# EAGLE design walkgeek (EAGLE 6.4)
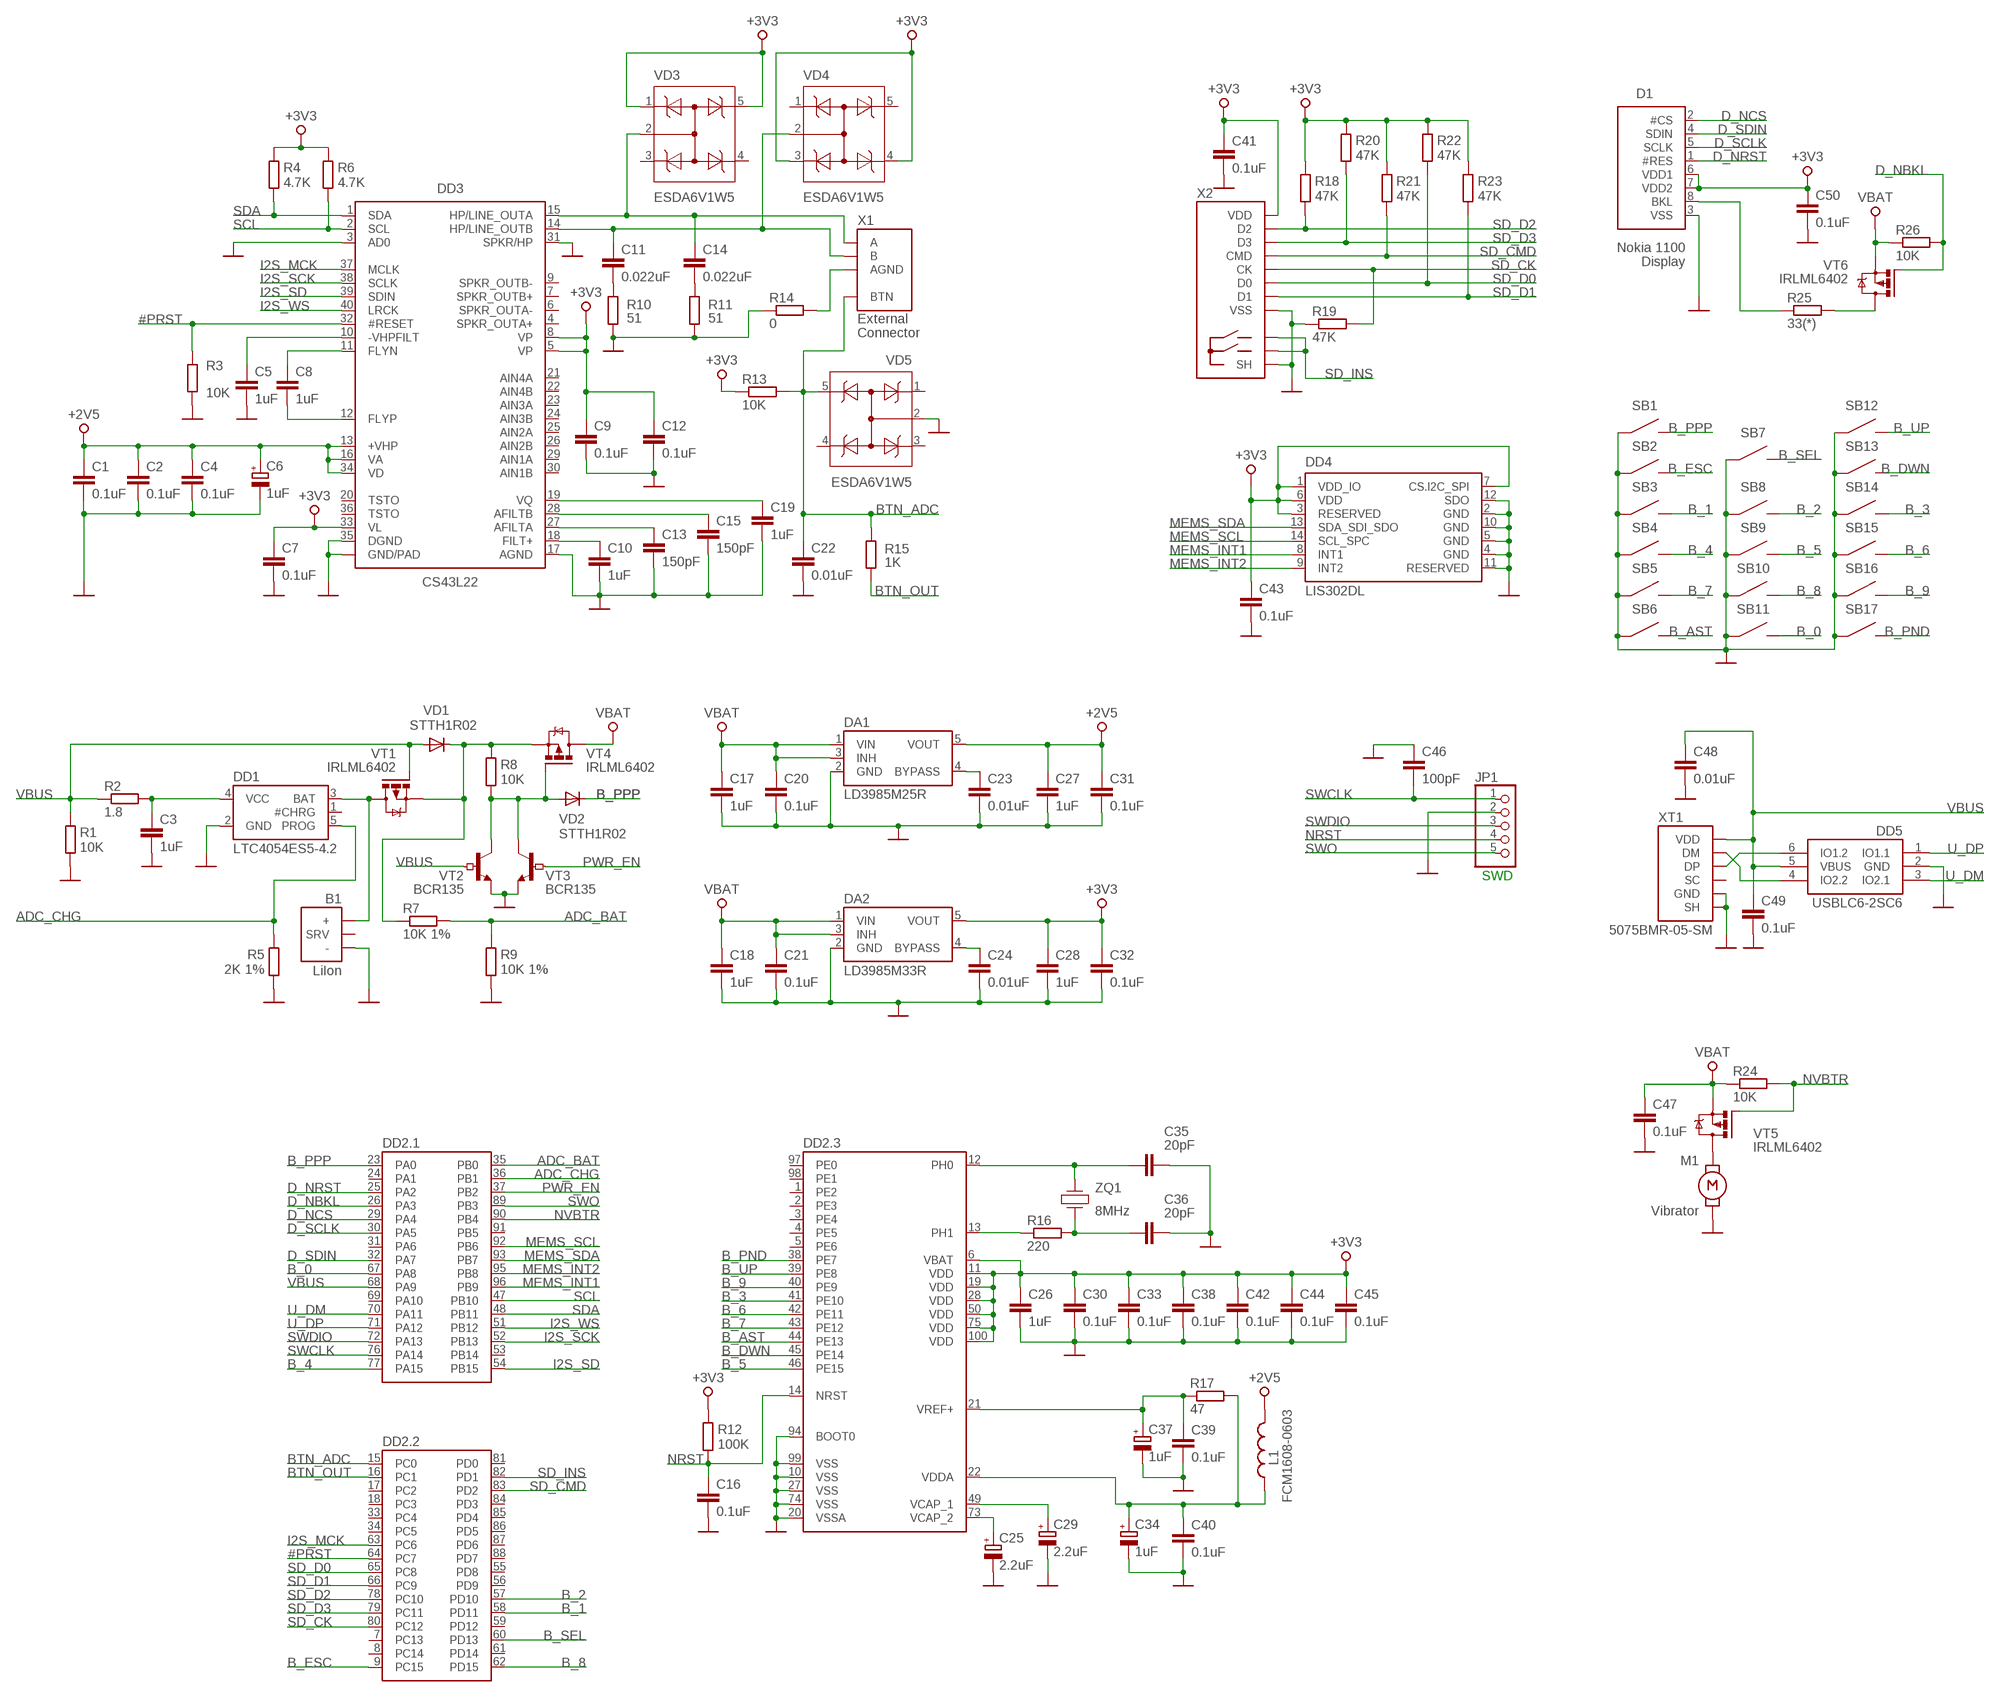
[diagram p0: schematic, sheet 1]

## Parts
B1  NOKIA1100_BATTERY_CONN  [NOKIA1100_BATTERY_CONN]
C1  0.1uF  C-EUC0402  [C0402]
C2  0.1uF  C-EUC0402  [C0402]
C3  1uF  C-EUC0805  [C0805]
C4  0.1uF  C-EUC0402  [C0402]
C5  1uF  C-EUC0603  [C0603]
C6  1uF  CPOL-EUSMCA  [SMC_A]
C7  0.1uF  C-EUC0402  [C0402]
C8  1uF  C-EUC0603  [C0603]
C9  0.1uF  C-EUC0402  [C0402]
C10  1uF  C-EUC0603  [C0603]
C11  0.022uF  C-EUC0603  [C0603]
C12  0.1uF  C-EUC0402  [C0402]
C13  150pF  C-EUC0603  [C0603]
C14  0.022uF  C-EUC0603  [C0603]
C15  150pF  C-EUC0603  [C0603]
C16  0.1uF  C-EUC0402  [C0402]
C17  1uF  C-EUC0603  [C0603]
C18  1uF  C-EUC0603  [C0603]
C19  1uF  C-EUC0603  [C0603]
C20  0.1uF  C-EUC0402  [C0402]
C21  0.1uF  C-EUC0402  [C0402]
C22  0.01uF  C-EUC0805  [C0805]
C23  0.01uF  C-EUC0603  [C0603]
C24  0.01uF  C-EUC0603  [C0603]
C25  2.2uF  CPOL-EUSMCA  [SMC_A]
C26  1uF  C-EUC0603  [C0603]
C27  1uF  C-EUC0603  [C0603]
C28  1uF  C-EUC0603  [C0603]
C29  2.2uF  CPOL-EUSMCA  [SMC_A]
C30  0.1uF  C-EUC0402  [C0402]
C31  0.1uF  C-EUC0402  [C0402]
C32  0.1uF  C-EUC0402  [C0402]
C33  0.1uF  C-EUC0402  [C0402]
C34  1uF  CPOL-EUSMCA  [SMC_A]
C35  20pF  C-EUC0603  [C0603]
C36  20pF  C-EUC0603  [C0603]
C37  1uF  CPOL-EUSMCA  [SMC_A]
C38  0.1uF  C-EUC0402  [C0402]
C39  0.1uF  C-EUC0402  [C0402]
C40  0.1uF  C-EUC0402  [C0402]
C41  0.1uF  C-EUC0402  [C0402]
C42  0.1uF  C-EUC0402  [C0402]
C43  0.1uF  C-EUC0402  [C0402]
C44  0.1uF  C-EUC0402  [C0402]
C45  0.1uF  C-EUC0402  [C0402]
C46  100pF  C-EUC0805  [C0805]
C47  0.1uF  C-EUC0402  [C0402]
C48  0.01uF  C-EUC0603  [C0603]
C49  0.1uF  C-EUC0402  [C0402]
C50  0.1uF  C-EUC0805  [C0805]
D1  NOKIA1100_DISP  [NOKIA1100_DISP]
DA1  LD3985M25R  LD3985MXXR  [TSOT23-5]
DA2  LD3985M33R  LD3985MXXR  [TSOT23-5]
DD1  LTC4054ES5-4.2  [TSOT23-5]
DD2  STM32F4XXVXT  [LQFP100]
DD3  CS43L22  [QFN40-6X6]
DD4  LIS302DL  [LGA14]
DD5  USBLC6-2SC6  [SOT23-6L]
JP1  PINHD-1X5  [1X05/90_FLAT]
L1  FCM1608-0603  FCM1608  [R0603]
M1  NOKIA1100_VIBRATOR  [NOKIA1100_VIBRATOR]
R1  10K  R-EU_R0603  [R0603]
R2  1.8  R-EU_R1206  [R1206]
R3  10K  R-EU_R0402  [R0402]
R4  4.7K  R-EU_R0603  [R0603]
R5  2K 1%  R-EU_R0805  [R0805]
R6  4.7K  R-EU_R0603  [R0603]
R7  10K 1%  R-EU_R0805  [R0805]
R8  10K  R-EU_R0805  [R0805]
R9  10K 1%  R-EU_R0805  [R0805]
R10  51  R-EU_R0603  [R0603]
R11  51  R-EU_R0603  [R0603]
R12  100K  R-EU_R0603  [R0603]
R13  10K  R-EU_R0805  [R0805]
R14  0  R-EU_R0603  [R0603]
R15  1K  R-EU_R0805  [R0805]
R16  220  R-EU_R0603  [R0603]
R17  47  R-EU_R0603  [R0603]
R18  47K  R-EU_R0805  [R0805]
R19  47K  R-EU_R0805  [R0805]
R20  47K  R-EU_R0805  [R0805]
R21  47K  R-EU_R0805  [R0805]
R22  47K  R-EU_R0805  [R0805]
R23  47K  R-EU_R0805  [R0805]
R24  10K  R-EU_R0603  [R0603]
R25  33(*)  R-EU_R1206  [R1206]
R26  10K  R-EU_R0603  [R0603]
SB1  NOKIA1100_KEY_PAD_0  [NOKIA1100_KEY_PAD_0]
SB2  NOKIA1100_KEY_PAD_0  [NOKIA1100_KEY_PAD_0]
SB3  NOKIA1100_KEY_PAD_0  [NOKIA1100_KEY_PAD_0]
SB4  NOKIA1100_KEY_PAD_0  [NOKIA1100_KEY_PAD_0]
SB5  NOKIA1100_KEY_PAD_0  [NOKIA1100_KEY_PAD_0]
SB6  NOKIA1100_KEY_PAD_0  [NOKIA1100_KEY_PAD_0]
SB7  NOKIA1100_KEY_PAD_0  [NOKIA1100_KEY_PAD_0]
SB8  NOKIA1100_KEY_PAD_0  [NOKIA1100_KEY_PAD_0]
SB9  NOKIA1100_KEY_PAD_0  [NOKIA1100_KEY_PAD_0]
SB10  NOKIA1100_KEY_PAD_0  [NOKIA1100_KEY_PAD_0]
SB11  NOKIA1100_KEY_PAD_0  [NOKIA1100_KEY_PAD_0]
SB12  NOKIA1100_KEY_PAD_0  [NOKIA1100_KEY_PAD_0]
SB13  NOKIA1100_KEY_PAD_0  [NOKIA1100_KEY_PAD_0]
SB14  NOKIA1100_KEY_PAD_0  [NOKIA1100_KEY_PAD_0]
SB15  NOKIA1100_KEY_PAD_0  [NOKIA1100_KEY_PAD_0]
SB16  NOKIA1100_KEY_PAD_0  [NOKIA1100_KEY_PAD_0]
SB17  NOKIA1100_KEY_PAD_0  [NOKIA1100_KEY_PAD_0]
VD1  STTH1R02  VD-SMA  [SMA]
VD2  STTH1R02  VD-SMA  [SMA]
VD3  ESDA6V1W5  [SOT323-5L]
VD4  ESDA6V1W5  [SOT323-5L]
VD5  ESDA6V1W5  [SOT323-5L]
VT1  IRLML6402  [MICRO3]
VT2  BCR135  VT_NPN_DIGITAL  [SOT23-BEC]
VT3  BCR135  VT_NPN_DIGITAL  [SOT23-BEC]
VT4  IRLML6402  [MICRO3]
VT5  IRLML6402  [MICRO3]
VT6  IRLML6402  [MICRO3]
X1  NOKIA1100_EXT_CONN  [NOKIA1100_EXT_CONN]
X2  MICROSD_CONN  [TFC-WPCE-08]
XT1  5075BMR-05-SM  USB_MINI_CONN  [32005-201]
ZQ1  8MHz  QUARTZ_5MM  [QUARTZ_5MM]

## Nets
#PRST: DD2.64(.2:PC7) DD3.32(#RESET) R3.2
+2V5: C1.1 C2.1 C4.1 C6.+ C27.1 C31.1 DA1.5(VOUT) DD3.13(+VHP) DD3.16(VA) DD3.34(VD) L1.1
+3V3: C7.1 C9.1 C12.1 C26.1 C28.1 C30.1 C32.1 C33.1 C38.1 C41.1 C42.1 C43.1 C44.1 C45.1 C50.1 D1.6(VDD1) D1.7(VDD2) DA2.5(VOUT) DD2.6(.3:VBAT) DD2.11(.3:VDD) DD2.19(.3:VDD) DD2.28(.3:VDD) DD2.50(.3:VDD) DD2.75(.3:VDD) DD2.100(.3:VDD) DD3.5(VP) DD3.8(VP) DD3.33(VL) DD4.1(VDD_IO) DD4.3(RESERVED) DD4.6(VDD) DD4.7(CS.I2C_SPI) R4.2 R6.2 R12.2 R13.1 R18.2 R20.2 R21.2 R22.2 R23.2 VD3.1 VD3.5 VD4.3 VD4.4 X2.VDD
ADC_BAT: DD2.35(.1:PB0) R7.2 R9.2
ADC_CHG: DD1.5(PROG) DD2.36(.1:PB1) R5.2
B_0: DD2.67(.1:PA8) SB11.INNER
B_1: DD2.58(.2:PD11) SB3.INNER
B_2: DD2.57(.2:PD10) SB8.INNER
B_3: DD2.41(.3:PE10) SB14.INNER
B_4: DD2.77(.1:PA15) SB4.INNER
B_5: DD2.46(.3:PE15) SB9.INNER
B_6: DD2.42(.3:PE11) SB15.INNER
B_7: DD2.43(.3:PE12) SB5.INNER
B_8: DD2.62(.2:PD15) SB10.INNER
B_9: DD2.40(.3:PE9) SB16.INNER
B_AST: DD2.44(.3:PE13) SB6.INNER
B_DWN: DD2.45(.3:PE14) SB13.INNER
B_ESC: DD2.9(.2:PC15) SB2.INNER
B_PND: DD2.38(.3:PE7) SB17.INNER
B_PPP: DD2.23(.1:PA0) SB1.INNER VD2.C
B_SEL: DD2.60(.2:PD13) SB7.INNER
B_UP: DD2.39(.3:PE8) SB12.INNER
BTN_ADC: C22.1 DD2.15(.2:PC0) R13.2 R15.2 VD5.5 X1.BTN
BTN_OUT: DD2.16(.2:PC1) R15.1
D_NBKL: DD2.26(.1:PA3) R26.2 VT6.1(G)
D_NCS: D1.2(#CS) DD2.29(.1:PA4)
D_NRST: D1.1(#RES) DD2.25(.1:PA2)
D_SCLK: D1.5(SCLK) DD2.30(.1:PA5)
D_SDIN: D1.4(SDIN) DD2.32(.1:PA7)
GND [power]: B1.- C1.2 C2.2 C3.2 C4.2 C5.2 C6.- C7.2 C9.2 C10.2 C12.2 C13.2 C15.2 C16.2 C17.2 C18.2 C19.2 C20.2 C21.2 C22.2 C23.2 C24.2 C25.- C26.2 C27.2 C28.2 C29.- C30.2 C31.2 C32.2 C33.2 C34.- C35.2 C36.2 C37.- C38.2 C39.2 C40.2 C41.2 C42.2 C43.2 C44.2 C45.2 C46.1 C47.2 C48.2 C49.2 C50.2 D1.3(VSS) DA1.2(GND) DA2.2(GND) DD1.2(GND) DD2.10(.3:VSS) DD2.20(.3:VSSA) DD2.27(.3:VSS) DD2.74(.3:VSS) DD2.94(.3:BOOT0) DD2.99(.3:VSS) DD3.3(AD0) DD3.17(AGND) DD3.31(SPKR/HP) DD3.35(DGND) DD3.EXP@3(GND/PAD) DD3.EXP@4(GND/PAD) DD3.EXP@5(GND/PAD) DD3.EXP@9(GND/PAD) DD4.2(GND) DD4.4(GND) DD4.5(GND) DD4.10(GND) DD4.11(RESERVED) DD4.12(SDO) DD5.2(GND) JP1.2 M1.2 R1.1 R3.1 R5.1 R9.1 R10.1 R11.1 R14.1 R19.1 SB1.OUTER SB1.OUTER1(OUTER) SB2.OUTER SB2.OUTER1(OUTER) SB3.OUTER SB3.OUTER1(OUTER) SB4.OUTER SB4.OUTER1(OUTER) SB5.OUTER SB5.OUTER1(OUTER) SB6.OUTER SB6.OUTER1(OUTER) SB7.OUTER SB7.OUTER1(OUTER) SB8.OUTER SB8.OUTER1(OUTER) SB9.OUTER SB9.OUTER1(OUTER) SB10.OUTER SB10.OUTER1(OUTER) SB11.OUTER SB11.OUTER1(OUTER) SB12.OUTER SB12.OUTER1(OUTER) SB13.OUTER SB13.OUTER1(OUTER) SB14.OUTER SB14.OUTER1(OUTER) SB15.OUTER SB15.OUTER1(OUTER) SB16.OUTER SB16.OUTER1(OUTER) SB17.OUTER SB17.OUTER1(OUTER) VD5.2 VT2.E VT3.E X2.SH1(SH) X2.SH2(SH) X2.SH3(SH) X2.SH4(SH) X2.VSS XT1.5(GND) XT1.M1(SH) XT1.M2(SH) XT1.M3(SH) XT1.M4(SH)
I2S_MCK: DD2.63(.2:PC6) DD3.37(MCLK)
I2S_SCK: DD2.52(.1:PB13) DD3.38(SCLK)
I2S_SD: DD2.54(.1:PB15) DD3.39(SDIN)
I2S_WS: DD2.51(.1:PB12) DD3.40(LRCK)
MEMS_INT1: DD2.96(.1:PB9) DD4.8(INT1)
MEMS_INT2: DD2.95(.1:PB8) DD4.9(INT2)
MEMS_SCL: DD2.92(.1:PB6) DD4.14(SCL_SPC)
MEMS_SDA: DD2.93(.1:PB7) DD4.13(SDA_SDI_SDO)
N$1: D1.8(BKL) R25.1
N$2: C10.1 DD3.18(FILT+)
N$3: C13.1 DD3.27(AFILTA)
N$4: C15.1 DD3.28(AFILTB)
N$5: C19.1 DD3.19(VQ)
N$6: C11.1 DD3.14(HP/LINE_OUTB) VD4.2 X1.B
N$7: C14.1 DD3.15(HP/LINE_OUTA) VD3.2 X1.A
N$8: C8.1 DD3.11(FLYN)
N$9: C8.2 DD3.12(FLYP)
N$10: C5.1 DD3.10(-VHPFILT)
N$11: R14.2 X1.AGND
N$12: C11.2 R10.2
N$13: C14.2 R11.2
N$14: M1.1 VT5.3(D)
N$16: C3.1 DD1.4(VCC) R2.2
N$17: R7.1 R8.2 VD1.C VT1.2(S) VT4.2(S)
N$18: DD2.13(.3:PH1) R16.1
N$19: R25.2 VT6.3(D)
N$21: R8.1 VD2.A VT2.C VT3.C VT4.1(G)
N$22: DD5.6(IO1.2) XT1.3(DP)
N$29: DD5.4(IO2.2) XT1.2(DM)
N$31: C25.+ DD2.73(.3:VCAP_2)
N$33: C35.1 DD2.12(.3:PH0) ZQ1.P$1
N$34: C24.1 DA2.4(BYPASS)
N$35: C23.1 DA1.4(BYPASS)
N$38: C29.+ DD2.49(.3:VCAP_1)
N$40: C34.+ C40.1 DD2.22(.3:VDDA) L1.2 R17.2
N$42: C37.+ C39.1 DD2.21(.3:VREF+) R17.1
N$44: C36.1 R16.2 ZQ1.P$2
NRST: C16.1 DD2.14(.3:NRST) JP1.4 R12.1
NVBTR: DD2.90(.1:PB4) R24.2 VT5.1(G)
PWR_EN: DD2.37(.1:PB2) VT3.B
SCL: DD2.47(.1:PB10) DD3.2(SCL) R6.1
SD_CK: DD2.80(.2:PC12) R19.2 X2.CLK(CK)
SD_CMD: DD2.83(.2:PD2) R21.1 X2.CMD
SD_D0: DD2.65(.2:PC8) R22.1 X2.DAT0(D0)
SD_D1: DD2.66(.2:PC9) R23.1 X2.DAT1(D1)
SD_D2: DD2.78(.2:PC10) R18.1 X2.DAT2(D2)
SD_D3: DD2.79(.2:PC11) R20.1 X2.CD/DAT3(D3)
SD_INS: DD2.82(.2:PD1) X2.SNS1 X2.SNS2
SDA: DD2.48(.1:PB11) DD3.1(SDA) R4.1
SWCLK: C46.2 DD2.76(.1:PA14) JP1.1
SWDIO: DD2.72(.1:PA13) JP1.3
SWO: DD2.89(.1:PB3) JP1.5
U_DM: DD2.70(.1:PA11) DD5.3(IO2.1)
U_DP: DD2.71(.1:PA12) DD5.1(IO1.1)
VBAT [power]: C17.1 C18.1 C20.1 C21.1 C47.1 DA1.1(VIN) DA1.3(INH) DA2.1(VIN) DA2.3(INH) R24.1 R26.1 VT4.3(D) VT5.2(S) VT6.2(S)
VBAT0 [power]: B1.+ DD1.3(BAT) VT1.3(D)
VBUS [power]: C48.1 C49.1 DD2.68(.1:PA9) DD5.5(VBUS) R1.2 R2.1 VD1.A VT1.1(G) VT2.B XT1.1(VDD)
Unconnected: B1.SERV(SRV) DD1.1(#CHRG) DD2.1(.3:PE2) DD2.2(.3:PE3) DD2.3(.3:PE4) DD2.4(.3:PE5) DD2.5(.3:PE6) DD2.7(.2:PC13) DD2.8(.2:PC14) DD2.17(.2:PC2) DD2.18(.2:PC3) DD2.24(.1:PA1) DD2.31(.1:PA6) DD2.33(.2:PC4) DD2.34(.2:PC5) DD2.53(.1:PB14) DD2.55(.2:PD8) DD2.56(.2:PD9) DD2.59(.2:PD12) DD2.61(.2:PD14) DD2.69(.1:PA10) DD2.81(.2:PD0) DD2.84(.2:PD3) DD2.85(.2:PD4) DD2.86(.2:PD5) DD2.87(.2:PD6) DD2.88(.2:PD7) DD2.91(.1:PB5) DD2.97(.3:PE0) DD2.98(.3:PE1) DD3.4(SPKR_OUTA+) DD3.6(SPKR_OUTA-) DD3.7(SPKR_OUTB+) DD3.9(SPKR_OUTB-) DD3.20(TSTO) DD3.21(AIN4A) DD3.22(AIN4B) DD3.23(AIN3A) DD3.24(AIN3B) DD3.25(AIN2A) DD3.26(AIN2B) DD3.29(AIN1A) DD3.30(AIN1B) DD3.36(TSTO) VD3.3 VD3.4 VD4.1 VD4.5 VD5.1 VD5.3 VD5.4 XT1.4(SC)

## Notes on the sheet
- SWD

## Library data of the parts
B1 = walkgeek-eagle:NOKIA1100_BATTERY_CONN
C1-C5 C7-C24 C26-C28 C30-C33 C35 C36 C38-C50 = walkgeek-eagle:C-EU: CAPACITOR, European symbol
C6 C25 C29 C34 C37 = walkgeek-eagle:CPOL-EU: POLARIZED CAPACITOR, European symbol
D1 = walkgeek-eagle:NOKIA1100_DISP
DA1 DA2 = walkgeek-eagle:LD3985MXXR
DD1 = walkgeek-eagle:LTC4054ES5-4.2
DD2 = walkgeek-eagle:STM32F4XXVXT
DD3 = walkgeek-eagle:CS43L22: CS43L22 edit this description Auto generated by make-symbol-device-package-bsdl.ulp Rev. 43 Source: CS43L22.txt
DD4 = walkgeek-eagle:LIS302DL: LIS302DL edit this description Auto generated by make-symbol-device-package-bsdl.ulp Rev. 43 Source: LIS302DL.txt
DD5 = walkgeek-eagle:USBLC6-2SC6
JP1 = walkgeek-eagle:PINHD-1X5
L1 = walkgeek-eagle:FCM1608
M1 = walkgeek-eagle:NOKIA1100_VIBRATOR
R1-R26 = walkgeek-eagle:R-EU_: RESISTOR, European symbol
SB1-SB17 = walkgeek-eagle:NOKIA1100_KEY_PAD_0
VD1 VD2 = walkgeek-eagle:VD-SMA
VD3-VD5 = walkgeek-eagle:ESDA6V1W5
VT1 VT4-VT6 = walkgeek-eagle:IRLML6402: HEXFET P-Channel Power MOSFET
VT2 VT3 = walkgeek-eagle:VT_NPN_DIGITAL
X1 = walkgeek-eagle:NOKIA1100_EXT_CONN
X2 = walkgeek-eagle:MICROSD_CONN
XT1 = walkgeek-eagle:USB_MINI_CONN
ZQ1 = walkgeek-eagle:QUARTZ_5MM

## Board
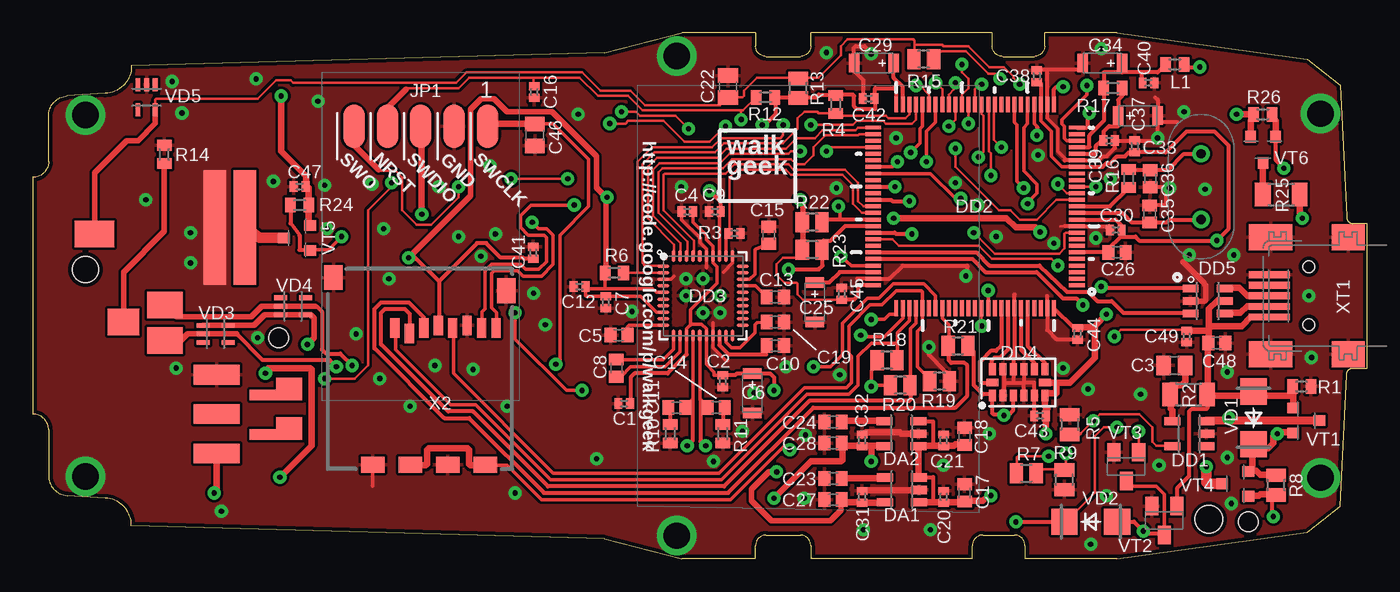
[diagram p1: board, top side]
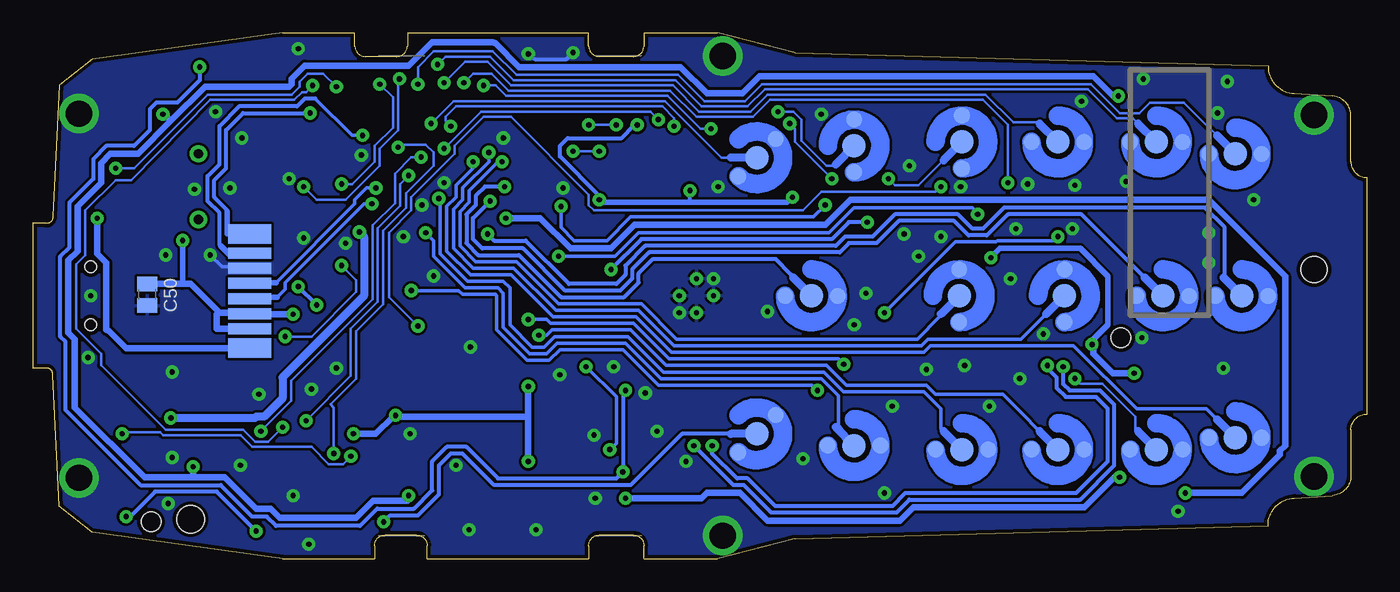
[diagram p2: board, bottom side, seen from below]

Size 101.5 x 40 mm. Coordinates in mm from the lower left corner, seen from the top.
Outline: 82.5,40 77,40 77,39 arc-90 76.2,38.2 73.8,38.2 arc-90 73,39 73,40 59.2,40 59.2,39 arc-90 58.4,38.2 55.8,38.2 arc-90 55,39 55,40 49.4,40 43.5,38.5 7.5,37.5 arc-90 5.5,35.4 2.6,35.2 arc82 1.2,33.8 1.2,30.2 arc-90 0,29 0,11 arc-90 1.2,9.8 1.2,6.2 arc82 2.6,4.8 5.5,4.6 arc-90 7.5,2.5 43.5,1.5 49.4,0 55,0 55,1 arc-90 55.8,1.8 58.4,1.8 arc-90 59.2,1 59.2,0 71.5,0 71.5,1 arc-90 72.3,1.8 74.7,1.8 arc-90 75.5,1 75.5,0 82.5,0 97,2 99.5,4 100,14 arc-103 100.5,14.5 101.5,14.5 101.5,25.5 100.5,25.5 arc-103 100,26 99.5,36 97,38 82.5,40
Copper layers (1*16): Top 0.018mm / dielectric 1mm / Bottom 0.018mm
Design rules "default *": minimum track width 0.2mm, minimum drill 0.4mm, track to track 0.2mm, track to pad 0.2mm, pad to pad 0.2mm, via to via 0.2mm, smd to smd 0.2mm, copper to edge 0.3mm, drill to drill 0.2mm, minimum pad ring 0.3mm, minimum via ring 0.3mm, stop-mask expansion 4mil, vias tented up to drill 0.45mm, thermal gap 0.2mm
Holes 1.5 mm at 18.7,16.8 92.5,2.8
tRestrict: 4 lines

### Footprints (pad centres in the part's own frame; a part is rotated, then mirrored left to right if it is on the bottom)
NOKIA1100_BATTERY_CONN = smd 1.5 x 3.5: + 6,0; - 0,0; SERV 3,0 | smd 0.8 x 2: P$1 1.55,3.5; P$3 4.55,3.5 | smd 1.7 x 2: P$2 1.1,5.5; P$4 4.1,5.5
C0402 = smd 0.6 x 0.8: 1 -0.45,0; 2 0.45,0
C0805 = smd 1.1 x 1.5: 1 -0.8,0; 2 0.85,0
C0603 = smd 0.9 x 1.1: 1 -0.65,0; 2 0.65,0
SMC_A = smd 0.8 x 1.4: + -1.5,0; - 1.5,0
NOKIA1100_DISP = smd 1.5 x 3.3: 1 4.69,0; 8 -3.97,0 | smd 0.84 x 3.3: 2 3.22,0; 3 2.08,0; 4 0.94,0; 5 -0.22,0; 6 -1.36,0; 7 -2.5,0 | hole 2.1: -17,4.5
TSOT23-5 = smd 0.62 x 1.22: 1 -0.95,-1.3; 2 0,-1.3; 3 0.95,-1.3; 4 0.95,1.3; 5 -0.95,1.3
LQFP100 = smd 1.2 x 0.3: 1 -7.75,6; 2 -7.75,5.5; 3 -7.75,5; 4 -7.75,4.5; 5 -7.75,4; 6 -7.75,3.5; 7 -7.75,3; 8 -7.75,2.5; 9 -7.75,2; 10 -7.75,1.5; 11 -7.75,1; 12 -7.75,0.5; 13 -7.75,0; 14 -7.75,-0.5; 15 -7.75,-1; 16 -7.75,-1.5; 17 -7.75,-2; 18 -7.75,-2.5; 19 -7.75,-3; 20 -7.75,-3.5; 21 -7.75,-4; 22 -7.75,-4.5; 23 -7.75,-5; 24 -7.75,-5.5; 25 -7.75,-6; 51 7.75,-6; 52 7.75,-5.5; 53 7.75,-5; 54 7.75,-4.5; 55 7.75,-4; 56 7.75,-3.5; 57 7.75,-3; 58 7.75,-2.5; 59 7.75,-2; 60 7.75,-1.5; 61 7.75,-1; 62 7.75,-0.5; 63 7.75,0; 64 7.75,0.5; 65 7.75,1; 66 7.75,1.5; 67 7.75,2; 68 7.75,2.5; 69 7.75,3; 70 7.75,3.5; 71 7.75,4; 72 7.75,4.5; 73 7.75,5; 74 7.75,5.5; 75 7.75,6 | smd 0.3 x 1.2: 26 -6,-7.75; 27 -5.5,-7.75; 28 -5,-7.75; 29 -4.5,-7.75; 30 -4,-7.75; 31 -3.5,-7.75; 32 -3,-7.75; 33 -2.5,-7.75; 34 -2,-7.75; 35 -1.5,-7.75; 36 -1,-7.75; 37 -0.5,-7.75; 38 0,-7.75; 39 0.5,-7.75; 40 1,-7.75; 41 1.5,-7.75; 42 2,-7.75; 43 2.5,-7.75; 44 3,-7.75; 45 3.5,-7.75; 46 4,-7.75; 47 4.5,-7.75; 48 5,-7.75; 49 5.5,-7.75; 50 6,-7.75; 76 6,7.75; 77 5.5,7.75; 78 5,7.75; 79 4.5,7.75; 80 4,7.75; 81 3.5,7.75; 82 3,7.75; 83 2.5,7.75; 84 2,7.75; 85 1.5,7.75; 86 1,7.75; 87 0.5,7.75; 88 0,7.75; 89 -0.5,7.75; 90 -1,7.75; 91 -1.5,7.75; 92 -2,7.75; 93 -2.5,7.75; 94 -3,7.75; 95 -3.5,7.75; 96 -4,7.75; 97 -4.5,7.75; 98 -5,7.75; 99 -5.5,7.75; 100 -6,7.75
QFN40-6X6 = smd 0.95 x 0.28: 1 -3.025,2.25; 2 -3.025,1.75; 3 -3.025,1.25; 4 -3.025,0.75; 5 -3.025,0.25; 6 -3.025,-0.25; 7 -3.025,-0.75; 8 -3.025,-1.25; 9 -3.025,-1.75; 10 -3.025,-2.25; 21 3.025,-2.25; 22 3.025,-1.75; 23 3.025,-1.25; 24 3.025,-0.75; 25 3.025,-0.25; 26 3.025,0.25; 27 3.025,0.75; 28 3.025,1.25; 29 3.025,1.75; 30 3.025,2.25 | smd 0.28 x 0.95: 11 -2.25,-3.025; 12 -1.75,-3.025; 13 -1.25,-3.025; 14 -0.75,-3.025; 15 -0.25,-3.025; 16 0.25,-3.025; 17 0.75,-3.025; 18 1.25,-3.025; 19 1.75,-3.025; 20 2.25,-3.025; 31 2.25,3.025; 32 1.75,3.025; 33 1.25,3.025; 34 0.75,3.025; 35 0.25,3.025; 36 -0.25,3.025; 37 -0.75,3.025; 38 -1.25,3.025; 39 -1.75,3.025; 40 -2.25,3.025 | drill 0.4: EXP@3 0,1.3; EXP@4 -1.3,0; EXP@5 1.3,0; EXP@9 0,-1.3
LGA14 = smd 0.9 x 0.55: 1 1,-2; 2 1,-1.2; 3 1,-0.4; 4 1,0.4; 5 1,1.2; 6 1,2; 8 -1,2; 9 -1,1.2; 10 -1,0.4; 11 -1,-0.4; 12 -1,-1.2; 13 -1,-2 | smd 0.55 x 0.9: 7 0,2; 14 0,-2
SOT23-6L = smd 0.55 x 1.2: 1 -0.95,-1.3; 2 0,-1.3; 3 0.95,-1.3; 4 0.95,1.3; 5 0,1.3; 6 -0.95,1.3
1X05/90_FLAT = smd 1.65 x 3.3: 1 0,0; 2 2.54,0; 3 5.08,0; 4 7.62,0; 5 10.16,0
R0603 = smd 0.8 x 1.1: 1 -0.7,0; 2 0.7,0
NOKIA1100_VIBRATOR = smd 8.7 x 1.7: 1 0,-1.15; 2 0,1.15
R1206 = smd 1.2 x 1.803: 1 -1.4,0; 2 1.4,0
R0402 = smd 0.6 x 0.8: 1 -0.45,0; 2 0.45,0
R0805 = smd 1 x 1.5: 1 -0.75,0; 2 0.75,0
NOKIA1100_KEY_PAD_0 = smd 1.8 x 1.8: INNER 0,0 | smd 1.2 x 1.2: OUTER 0,2; OUTER1 0,-2
SMA = smd 2 x 2: A 2,0; C -2,0
SOT323-5L = smd 0.35 x 1: 1 -0.65,-0.95; 2 0,-0.95; 3 0.65,-0.95; 4 0.65,0.95; 5 -0.65,0.95
MICRO3 = smd 0.8 x 0.9: 1 -0.95,-1; 2 0.95,-1; 3 0,1
SOT23-BEC = smd 1 x 1.4: B -0.95,-1.1; C 0,1.1; E 0.95,-1.1
NOKIA1100_EXT_CONN = smd 2 x 2.7: A 3.4,10.05; B 0.7,10.05 | smd 2 x 2.4: AGND 2,6.9 | smd 2 x 3: BTN -4.7,4.7 | hole 2: -2,4
TFC-WPCE-08 = smd 0.7 x 1.5: CD/DAT3 7.82,-10.3; CLK 4.52,-10.7; CMD 6.72,-10.7; DAT0 2.32,-10.7; DAT1 1.22,-10.7; DAT2 8.92,-10.7; VDD 5.62,-10.9; VSS 3.42,-10.9 | smd 1.4 x 1.9: SH1 0.45,-13.55; SH2 13.6,-14.55 | smd 1.8 x 1.2: SH3 4.9,-0.3; SH4 10.6,-0.3; SNS1 2.05,-0.3; SNS2 7.75,-0.3
32005-201 = smd 3.1 x 0.5: 1 3,1.6; 2 3,0.8; 3 3,0; 4 3,-0.8; 5 3,-1.6 | smd 2.5 x 2: M1 -3,-4.45; M2 -3,4.45 | smd 3.3 x 2: M3 2.9,4.45; M4 2.9,-4.45 | hole 0.9: 0,2.2; 0,-2.2
QUARTZ_5MM = drill 0.7: P$1 2.5,0; P$2 -2.5,0

### Placement (x,y rotation side)
B1  14,14 270 top
C1  45,11.8 180 top
C2  52.5,13.5 270 top
C3  86.9,14.7 180 top
C4  49.8,26.4 180 top
C5  44.6,17 180 top
C6  54.75,12.6 270 top
C7  43.6,19.5 270 top
C8  44.4,14.5 270 top
C9  51.9,26.4 180 top
C10  56.5,16.2 0 top
C11  49,11.5 180 top
C12  41.6,20.7 180 top
C13  56.5,19.9 0 top
C14  52,11.5 0 top
C15  56,24.6 90 top
C16  38.15,35.5 270 top
C17  70.9,5 90 top
C18  70.9,9.3 90 top
C19  56.5,18 0 top
C20  69.3,4.7 90 top
C21  69.3,9 90 top
C22  52.9,35.9 90 top
C23  60.9,6.1 180 top
C24  60.9,10.4 180 top
C25  59.5,19.5 270 top
C26  82.5,23.3 0 top
C27  60.9,4.5 180 top
C28  60.9,8.8 180 top
C29  64,37.7 180 top
C30  82.4,25 180 top
C31  63.1,4.7 90 top
C32  63.1,9 90 top
C33  83.85,31.37 90 top
C34  81.4,37.7 180 top
C35  84.99,26.22 90 top
C36  85.03,28.9 270 top
C37  84.1,33.7 0 top
C38  76.4,36.7 90 top
C39  81.9,31.8 0 top
C40  84.9,36.2 0 top
C41  38.08,23.27 90 top
C42  63.6,35 180 top
C43  76.65,10.87 180 top
C44  79.5,17.1 270 top
C45  61.55,20.15 90 top
C46  38.2,32.2 90 top
C47  20.3,28.3 180 top
C48  90.1,16.4 0 top
C49  87.8,16.9 270 top
C50  92.8,20.1 270 bottom
D1  85,20 90 bottom
DA1  66.13,5.23 90 top
DA2  66.1,9.5 90 top
DD1  88,9.5 90 top
DD2  71.7,26.8 180 top
DD3  51,20 0 top
DD4  75.02,13.41 270 top
DD5  89.4,19.6 270 top
JP1  34.6,32.9 180 top
L1  86.9,37.6 180 top
M1  15,25.2 90 top
R1  96.55,13.1 180 top
R2  87.95,12.5 180 top
R3  53.4,24.75 180 top
R4  61.1,34.55 90 top
R5  78.9,10.2 270 top
R6  44.25,21.75 180 top
R7  75.6,6.5 0 top
R8  94.6,5.6 90 top
R9  78.5,6 90 top
R10  48.5,9.5 90 top
R11  52.5,9.5 90 top
R12  55.75,35.1 0 top
R13  58.25,35.8 90 top
R14  10,30.75 270 top
R15  67.8,38 180 top
R16  83.39,28.92 90 top
R17  82.2,35.8 180 top
R18  65,15.1 180 top
R19  69,13.5 180 top
R20  66,13.2 180 top
R21  70.4,16.2 0 top
R22  59.3,25.6 180 top
R23  59.3,23.5 180 top
R24  20.3,26.9 180 top
R25  95,27.7 180 top
R26  93.6,33.8 0 top
SB1  46.4,9.5 315 bottom
SB2  39,8.6 270 bottom
SB3  30.8,8.3 270 bottom
SB4  23.5,8.3 270 bottom
SB5  16,8.3 270 bottom
SB6  10,9.2 270 bottom
SB7  42.25,20 270 bottom
SB8  31,20 0 bottom
SB9  23,20 0 bottom
SB10  15.5,20 270 bottom
SB11  9.5,20 270 bottom
SB12  46.4,30.5 315 bottom
SB13  39,31.4 0 bottom
SB14  30.8,31.7 0 bottom
SB15  23.5,31.7 270 bottom
SB16  16,31.7 270 bottom
SB17  10,30.8 270 bottom
VD1  92.89,10.71 90 top
VD2  80.5,2.81 0 top
VD3  13.9,17.1 270 top
VD4  19.8,19.2 270 top
VD5  8.66,35.1 180 top
VT1  96.9,10.5 270 top
VT2  86.1,2.9 180 top
VT3  83.2,7 180 top
VT4  91.5,5.7 90 top
VT5  20.1,24.4 90 top
VT6  93.6,31.1 180 top
X1  0,20 270 top
X2  36.47,6.84 180 top
XT1  97.1,20 180 top
ZQ1  88.9,28.3 270 top

### Tracks (layer width: path | path; a pad name or v marks a point on that pad's centre or on a via)
#PRST
  Top 0.2: R3.2 53,25.2 53,29 53.6,29.6 57.3,29.6 57.7,29.2 61.6,29.2 62.4,28.4 62.4,27 63.1,26.3 DD2.64
  Top 0.26: R3.2 52.75,24.95 DD3.32
  Top 0.3: 52.8,24.7 R3.2
+2V5  (via drill 0.4)
  Top 0.2: 51.8,23.1 DD3.34
  Top 0.26: 49.75,15.55 DD3.13 49.75,17.5 49.95,17.7 50.05,17.75 50.05,17.9 | C2.1 51.85,13.95 51.85,14.2 51.25,14.8 DD3.16 51.25,17.5 50.9,17.85 50.15,17.85 50.1,17.9 50.05,17.9 | C4.1 50.25,25.6 51.25,24.6 51.25,24.25 51.75,23.75 DD3.34 51.75,22.5 52.05,22.2 52.05,20.95 50.05,18.95 50.05,17.9
  Top 0.3: 54.9,14 C6.+ | 49.75,15.55 48.3,14.1 45.8,14.1 45.5,13.8 45.5,11.8 C1.1 45.5,11.7 | C6.+ 53.6,14.1 53.5,14 52.6,14 C2.1 | v56.4,12.8 56.4,13.8 56.1,14.1 C6.+ | v88.8,37.4 87.6,37.4 L1.1
  Top 0.4: 61.5,4.5 61.5,4.45 | 61.5,4.4 61.5,4.3 61.5,3.7 60.7,2.9 56.2,2.9 54.7,4.4 54.7,5.3 56,6.6 v56.6,6.6 | 61.5,4.4 61.55,4.45 C27.1 61.5,4.45 | 61.5,4.4 61.5,4.45
  Top 0.5: DA1.5 64.83,4.25 C31.1 62.9,4.3 61.5,4.3
  Bottom 0.3: v56.4,12.8 56.6,12.6 v56.6,6.6 57.1,6.1 66.1,6.1 68.5,8.5 70,8.5 71.1,7.4 71.1,5.2 72.5,3.8 75.3,3.8 76.6,2.5 83,2.5 83.7,3.2 84.8,3.2 87.2,5.6 93.3,5.6 99,11.3 99,16.5 99.4,16.9 99.4,23 98.7,23.7 98.7,27.1 96.9,28.9 96.9,30.4 95.9,31.4 93.8,31.4 92.6,32.6 92.6,34.2 92.1,34.7 90.5,34.7 88.8,36.4 v88.8,37.4
+3V3  (via drill 0.4)
  Top 0.2: C45.1 58.6,19.7 58.2,20.1 58.2,20.9 58.1,21 57.2,21 56.6,21.6 56.6,22.4 57.1,22.9 58.6,22.9 58.6,23.4 R23.2
  Top 0.26: C38.1 76.4,36.3 76.6,36.3 | DD2.28 76.7,33.3 77.5,32.5 77.5,30.6 78.3,29.8 DD2.19 | 64.3,14.8 63.8,14.3 v63.8,13.1 63.9,13.2 R20.2 65.3,13.7 | C9.1 52.25,26.3 DD3.33 | 43.55,20.55 47.15,20.55 47.45,20.25 DD3.5 | 43.55,20.55 42.05,20.55 C12.1 42.05,20 42.1,19.95 C7.1 46.25,19.95 47.45,18.75 DD3.8 | 43.55,20.55 R6.2
  Top 0.3: DD2.11 82.4,25.8 82.8,25.4 82.8,25 C30.1 82.8,24.9 82.8,24.5 | DD2.6 C26.1 81.9,23.4 81.9,23.6 82.8,24.5 | 73.9,11 73.1,11 73,11.1 73,12.4 DD4.1 72.9,12.5 72.3,12.5 71.6,13.2 71.6,15.75 R21.2 | 73.9,11 74.3,11 74.6,11.3 74.6,12.4 DD4.3 | v73.9,10.9 73.9,11 | 64.1,34.9 64,35 C42.1 | 65.7,34.9 DD2.50 65.7,35.6 65.5,35.8 64.1,35.8 64.1,35.2 C42.1 | 43.6,21.8 R6.2 | DD2.28 76.7,36.2 76.6,36.3 | DD2.19 81.4,29.8 81.7,30.1 82,30.1 82.5,30.6 83.1,30.6 83.4,30.9 83.8,30.9 C33.1 84,30.9 86.2,30.9 87.8,32.5 89.9,32.5 91,31.4 91,25.1 v90.1,24.2 84.2,24.2 83.9,24.5 82.8,24.5 | 64.1,35.1 C42.1 | 38,22.8 C41.1 37.9,22.8 37.4,22.8 37.3,22.9 35.6,22.9 34.5,24 33.8,24 30.9,21.1 | 30.9,18 X2.VDD 30.9,18.1 30.9,21.1 | 30.9,21.1 28.9,23.1 v28.6,22.9 | 43.6,27.5 v43.7,27.5 | R4.2 61.1,35.3 62.4,35.3 62.5,35.2 62.5,34.4 62.7,34.2 64.1,34.2 64.1,34.8 C42.1 | 61,35.3 R4.2 | R4.2 60.9,35.3 59.8,35.3 59.6,35.1 58.3,35.1 R13.1 58.2,35.1 R12.2 56.5,35.1 56.5,33.8 55.7,33 v55.5,33 | DD2.75 63,20.8 62.8,20.6 62.8,20 62.5,19.7 C45.1 | C9.1 52.3,27.2 v51.5,28 | DD2.100 79.2,17.6 79.3,17.6 C44.1 | R18.2 64.25,14.85 64.3,14.8
  Top 0.4: VD3.1 VD3.5 16.85,17.75 17.65,18.55 VD4.3 VD4.4 21.15,18.55 21.4,18.3 21.4,16.8 v20.9,16.3 | R6.2 43.6,21.9 43.6,27.5 42.9,28.2 42.9,30.6 39.5,34 36.1,34 35.1,35 34.1,35 33.3,34.2 33.3,27.6 v28.6,22.9 | v58.4,27.3 58.5,27.2 58.6,27.2 58.6,25.6 R22.2 58.6,25.5 58.6,23.5 R23.2
  Top 0.5: 63.8,8.6 64.8,8.6 DA2.5 | 63.8,8.6 63.1,8.6 C32.1 62.9,8.6 61.5,8.6 61.5,8.8 C28.1 61.6,8.4 61.6,7.5 61.5,7.4 59.2,7.4 v56.4,4.6 | 30.9,17.8 X2.VDD | 79.6,17.6 C44.1 79.8,17.6 80.7,17.6 80.8,17.5 | v63.8,7.4 63.8,8.6 | 65.3,13.5 R20.2 | v77.1,9.5 C43.1 77.1,11.3 77.2,11.4 77,11.6 77,12.4 DD4.6 77.2,12.6 77.9,12.6 77.9,13.4 | 77.9,13.4 77.2,13.4 DD4.7 | 80.8,17.5 80.8,15.3 78.9,13.4 77.9,13.4 | v81.7,18.6 80.8,17.7 80.8,17.5 | v17.7,14.1 17.7,14.3 17.9,14.5 21.1,14.5 21.2,14.4 21.2,8.6 v18.8,6.2
  Bottom 0.3: v58.4,27.3 58.5,27.4 58.5,27.7 61.4,30.6 61.4,31.4 60.8,32 56.7,32 55.7,33 v55.5,33 | 51.5,27.1 v51.5,28
  Bottom 0.4: 20.7,16.1 v20.9,16.3 20.8,16.4 20.8,16.7 19.7,17.8 19.7,21.5 21.8,23.6 27.9,23.6 v28.6,22.9 | 90.1,20.9 v90.1,24.2 | v43.7,27.5 44.1,27.1 51.5,27.1 58.2,27.1 v58.4,27.3
  Bottom 0.5: C50.1 90.1,20.9 89.5,20.9 87.3,18.7 | 87.3,18.7 86.5,18.7 86.4,18.6 85,18.6 D1.6 | D1.7 87.5,17.5 87.5,18.6 87.3,18.7 | 84.8,18.6 D1.6 | v63.8,13.1 63.8,10.8 | 63.8,10.8 v63.8,7.4 | 63.8,10.8 73.8,10.8 v73.9,10.9 74.1,10.8 75.4,9.5 v77.1,9.5 | v81.7,18.6 84.6,18.6 D1.6 | v56.4,4.6 50.6,4.6 50.2,5 47.7,5 45.6,2.9 35.5,2.9 34.5,3.9 21.5,3.9 19.2,6.2 v18.8,6.2 | v17.7,14.1 19.3,14.1 20.8,15.6 20.8,16 v20.9,16.3
ADC_BAT  (via drill 0.4)
  Top 0.2: v73.7,31.3 73.15,31.85 73.15,34.15 73.2,34.2 DD2.35 | v78.6,8 78.6,6.8 78.5,6.7 R9.2 78.5,6.8 76.4,6.8 76.4,6.5 R7.2
  Bottom 0.2: v73.7,31.3 73.5,31.5 71.6,31.5 71,30.9 71,29.9 73.1,27.8 73.1,26.7 74.85,24.95 74.85,19.35 76.9,17.3 76.9,13.7 78.85,11.75 78.6,11.5 v78.6,8 78.6,7.8
ADC_CHG  (via drill 0.4)
  Top 0.2: v72.9,29.15 72.9,30.85 72.75,31 72.75,34.15 72.7,34.2 DD2.36 | 79.7,9.5 v80.7,10.5 81.2,11 84.2,11 85.2,10 85.2,8.9 85.5,8.6 86.6,8.6 DD1.5
  Top 0.26: 79.7,9.5 79,9.5 R5.2
  Top 0.3: 86.7,8.6 DD1.5 | 78.9,9.5 R5.2
  Bottom 0.2: v72.9,29.15 73.55,28.5 73.55,26.85 75.25,25.15 75.25,19.55 77.3,17.5 77.3,13.9 v80.7,10.5
B_0  (via drill 0.4)
  Top 0.3: v66.9,24.7 65.7,24.7 65.6,24.8 DD2.67
  Bottom 0.3: SB11.INNER 10.2,20 10.2,20.9 10.8,21.5 10.8,25.2 12.3,26.7 27.6,26.7 29.2,25.1 30,25.1 31.1,26.2 35.9,26.2 37.6,24.5 39.7,24.5 40.4,23.8 54.9,23.8 56.4,22.3 56.4,21.6 57.1,20.9 60.7,20.9 64,24.2 66.4,24.2 v66.9,24.7
B_1  (via drill 0.4)
  Top 0.26: DD2.58 68.3,29.3 70.2,27.4 v70.6,27.4
  Bottom 0.26: v70.6,27.4 70.5,27.3 70.5,23.2 68.4,21.1 65.7,21.1 65.2,20.6 65.2,17.8 63.5,16.1 62.6,16.1 61.8,16.9 56.2,16.9 53.5,14.2 41.3,14.2 39.8,12.7 33.7,12.7 32.4,11.4 32.4,9.9 SB3.INNER
B_2  (via drill 0.4)
  Top 0.26: DD2.57 65.4,29.8 v65.8,30.2
  Bottom 0.26: v65.8,30.2 66.1,30.2 68.3,28 68.3,27.1 69,26.4 69,23.8 67.8,22.6 64.7,22.6 61.5,19.4 55.2,19.4 52.5,16.7 34.2,16.7 32.5,18.4 SB8.INNER
B_3  (via drill 0.4)
  Top 0.2: DD2.41 70.2,33.4 v69.7,32.9 | v36.4,28.9 v40.7,28.9 | v43.9,33.1 45.1,33.1 45.3,33.3 48,33.3 49.6,31.7 51.5,31.7 v52.7,32.9
  Bottom 0.2: v69.7,32.9 70.1,33.3 70.1,33.6 69.3,34.4 53.6,34.4 52.7,33.5 v52.7,32.9 | v40.7,28.9 43.5,31.7 43.5,32.7 v43.9,33.1 | v36.4,28.9 35.9,28.4 34.1,28.4 SB14.INNER
B_4  (via drill 0.4)
  Top 0.26: DD2.77 66.2,18.3 64.8,16.9 63.1,16.9 v63,17
  Bottom 0.26: v63,17 62.4,17 62,17.4 56,17.4 53.3,14.7 41.1,14.7 39.6,13.2 33.5,13.2 32.8,12.5 27.7,12.5 SB4.INNER
B_5  (via drill 0.4)
  Top 0.26: DD2.46 67.7,32.9 67.5,32.7 67.5,31.6 v66.8,30.9
  Bottom 0.26: v66.8,30.9 66.8,30.2 68.8,28.2 68.8,27.3 69.5,26.6 69.5,23.6 68,22.1 64.9,22.1 61.7,18.9 55.4,18.9 52.7,16.2 33.9,16.2 33.4,16.7 26.3,16.7 SB9.INNER
B_6  (via drill 0.4)
  Top 0.2: DD2.42 69.7,35.3 70.1,35.7 v70.2,36.2
  Bottom 0.2: SB15.INNER 25.1,33.2 26.9,33.2 29,35.3 45.6,35.3 46.9,34 50.8,34 52.8,36 65.1,36 66.9,37.8 68.6,37.8 v70.2,36.2
B_7  (via drill 0.4)
  Top 0.2: v22.2,13.7 24.5,13.7 25.5,14.7 25.5,26.5 27.3,28.3 v27.3,28.6 | DD2.43 69.2,35.7 v68.7,36.2
  Bottom 0.2: v27.3,28.6 27.3,33 29.2,34.9 45.4,34.9 46.7,33.6 51,33.6 53,35.6 65.3,35.6 66.6,36.9 68,36.9 v68.7,36.2 | 17.6,9.7 SB5.INNER 17.6,9.9 17.6,10.8 20.1,13.3 21.8,13.3 v22.2,13.7
B_8  (via drill 0.4)
  Top 0.3: v66.7,27.2 65.4,27.2 65.3,27.3 DD2.62
  Bottom 0.3: SB10.INNER 21.7,26.2 27.3,26.2 28.9,24.6 30.3,24.6 31.4,25.7 35.6,25.7 37.3,24 39.4,24 40.1,23.3 54.6,23.3 55.9,22 55.9,21.3 56.8,20.4 61,20.4 64.2,23.6 67.3,23.6 68,24.3 68,25.9 v66.7,27.2
B_9  (via drill 0.4)
  Top 0.2: DD2.40 70.7,35.3 71.2,35.8 71.2,36.5 70.7,37 v70.7,37.6
  Bottom 0.2: SB16.INNER 17.8,33.5 19,33.5 21.2,35.7 45.8,35.7 47.1,34.4 50.6,34.4 52.6,36.4 64.9,36.4 66.7,38.2 70.1,38.2 v70.7,37.6
B_AST  (via drill 0.4)
  Top 0.26: DD2.44 68.7,33.2 68,32.5 v68,30.2
  Bottom 0.26: v68,30.2 68,29.7 69.3,28.4 69.3,27.5 70,26.8 70,23.4 68.2,21.6 65.1,21.6 61.9,18.4 55.6,18.4 52.9,15.7 33.7,15.7 33.2,16.2 22.3,16.2 17.5,11.4 12.2,11.4 SB6.INNER
B_DWN  (via drill 0.4)
  Top 0.2: v44.8,34 45.9,34 46.2,33.7 48.9,33.7 v49.9,32.7 | DD2.45 68.2,35.3 67.5,36 v67.2,36
  Bottom 0.2: SB13.INNER 40.5,29.9 41.1,29.9 43,31.8 43,33.4 43.6,34 v44.8,34 | v49.9,32.7 50.7,32.7 53.2,35.2 65.5,35.2 66.3,36 v67.2,36
B_ESC  (via drill 0.4)
  Top 0.2: DD2.9 78.6,24.8 78.5,24.7 78.5,23.6 78.1,23.2 73.2,23.2 v71.6,24.8
  Bottom 0.26: v71.6,24.8 71,24.2 71,23 68.6,20.6 66.1,20.6 65.7,20.2 65.7,17.6 63.7,15.6 62.4,15.6 61.6,16.4 56.4,16.4 53.7,13.7 41.5,13.7 40.2,12.4 40.2,10.2 SB2.INNER
B_PND  (via drill 0.4)
  Top 0.2: DD2.38 71.7,35.7 72.1,36.1 v72.2,36.1
  Bottom 0.2: SB17.INNER 13.9,34.7 16.5,34.7 17.3,33.9 18.8,33.9 21,36.1 46,36.1 47.3,34.8 50.4,34.8 52.4,36.8 64.7,36.8 66.5,38.6 71,38.6 72.2,37.4 v72.2,36.1
B_PPP  (via drill 0.4)
  Top 0.2: v82.5,10 81.5,10 80.8,9.3 80.8,5 78.3,2.5
  Top 0.26: v80.2,36 80.2,35.3 78.3,33.4 78.3,33.1 78.5,32.9 78.5,32 78.7,31.8 DD2.23 | 78.3,2.5 78.5,2.7 VD2.C
  Top 0.3: v74.8,2.8 VD2.C
  Bottom 0.2: v80.2,36 80.7,35.5 81,35.5 81.6,34.9 88,34.9 94,28.8 95.2,28.8 97.5,26.5 97.5,23.1 98.2,22.4 98.2,17.5 96.3,15.6 96.3,14.7 91.4,9.8 85.5,9.8 84.6,8.9 83.6,8.9 v82.5,10
  Bottom 0.3: 48.1,9.6 47.3,9.6 46.9,10 SB1.INNER 52.1,9.5 56,5.6 66.4,5.6 68.8,8 69.7,8 70.6,7.1 70.6,4.9 72.2,3.3 74.3,3.3 v74.8,2.8
B_SEL  (via drill 0.4)
  Top 0.3: DD2.60 v65.6,28.3
  Bottom 0.3: v65.6,28.3 67.1,28.3 67.8,27.6 67.8,26.9 68.5,26.2 68.5,24 67.6,23.1 64.5,23.1 61.3,19.9 56.5,19.9 55.4,21 55.4,21.7 54.3,22.8 45,22.8 43.8,21.6 SB7.INNER
B_UP  (via drill 0.4)
  Top 0.2: DD2.39 v71.2,33.1
  Bottom 0.2: v71.2,33.1 69.5,34.8 53.4,34.8 49.1,30.5 SB12.INNER
BTN_ADC  (via drill 0.4)
  Top 0.2: VD5.5 9.3,34.4 9.3,34.9 9.4,35 17.1,35 18.5,36.4 19.6,36.4 19.8,36.2 32.2,36.2 33,37 41.8,37 43.2,35.6 45.5,35.6 46.6,34.5 52.3,34.5 C22.1 54,35.1 54.1,35.2 54.1,35.6 55.1,36.6 58.2,36.6 R13.2 58.3,36.6 59.8,36.6 61.5,38.3 61.5,39 62,39.5 67,39.5 67.1,39.4 67.1,39.1 | DD2.15 78.7,27.8 v78,28.5 | v75.1,36.1 74.6,36.6 74.6,36.7 73.9,37.4 72.8,37.4 71.2,39 69.3,39 69.2,39.1 67.1,39.1 | 67.1,39.1 67.1,38 R15.2
  Top 0.3: 9.3,34.3 VD5.5
  Top 0.4: X1.BTN 4.7,29.34 7.16,31.8 8,31.8 9.31,33.11 VD5.5
  Bottom 0.2: v78,28.5 77.2,28.5 75.5,30.2 75.5,31.4 74.1,32.8 74.1,35.1 v75.1,36.1
BTN_OUT  (via drill 0.4)
  Top 0.2: v80.9,28.3 DD2.16 | v73.6,36.5 73.2,36.9 72.7,36.9 71,38.6 69.15,38.6 R15.1
  Bottom 0.2: v80.9,28.3 79.9,27.3 77.7,27.3 75.1,29.9 75.1,31.2 73.7,32.6 73.7,36.4 v73.6,36.5
D_NBKL  (via drill 0.4)
  Top 0.3: 77.7,34.4 DD2.26 77.7,35.7 77.9,35.9 v78.4,35.9 | v95.2,29.7 94.6,30.3 94.6,31.9 VT6.1
  Top 0.5: R26.2 94.3,33.6 94.6,33.3 94.6,32.1 VT6.1
  Bottom 0.2: v78.4,35.9 79.4,36.9 80.6,36.9 81.2,36.3 81.2,35.9 81.8,35.3 88.2,35.3 93.8,29.7 v95.2,29.7
D_NCS  (via drill 0.4)
  Top 0.26: 76.45,32.85 76.2,33.1 DD2.29 | 76.45,32.85 76.5,32.8 | v76.4,32.2 76.4,32.8 76.45,32.85
  Bottom 0.26: 80,35 77.2,32.2 v76.4,32.2
  Bottom 0.3: 87.2,23.8 87.3,23.9 87.3,26.3 88.2,27.2 88.2,29.1 87.3,30 87.3,32.9 85.8,34.4 81.4,34.4 80.8,35 80,35 | 86.5,23.1 86.4,23.2 85,23.2 D1.2
  Bottom 0.4: 86.5,23.1 87.2,23.8
D_NRST  (via drill 0.4)
  Top 0.3: DD2.25 80.2,32.8 80.3,32.9 80.3,33.8 v80.4,33.9
  Bottom 0.3: D1.1 85.1,24.7 86.7,24.7 | 86.7,26.4 86.7,26.5 87.7,27.5 87.7,28.8 86.8,29.7 86.8,32.6 85.5,33.9 v80.4,33.9
  Bottom 0.4: 86.7,24.7 86.7,26.4
D_SCLK  (via drill 0.4)
  Top 0.26: v75.7,27 76.1,27.5 76.4,27.8 76.4,28.5 75.4,29.5 75.4,32.8 75.7,33.1 DD2.30
  Bottom 0.26: 84.9,19.8 D1.5 84.8,19.8 83.6,19.8 83.5,19.9 | 82.9,19.9 82.3,20.5 82.3,21 76.3,27 v75.7,27
  Bottom 0.3: 85,19.8 D1.5
  Bottom 0.4: 83.5,19.9 82.9,19.9
D_SDIN  (via drill 0.4)
  Top 0.26: DD2.32 74.7,33.2 74.9,33 74.9,28.7 v75.4,28.2
  Bottom 0.26: 83.5,21 83.6,20.9 84.9,20.9 D1.4 | v75.4,28.2 76.1,28.2 77,27.3 77,27 83,21
  Bottom 0.3: 85,20.9 D1.4
  Bottom 0.4: 83.5,21 83,21
GND  (via drill 0.4, 2 pad 3)
  Top 0.2: 78.5,25.3 78.2,25.3
  Top 0.25: DD3.17 51.75,17.5
  Top 0.26: 52.55,21.8 53.25,22.5 DD3.31 53.25,23.35 | 76.4,37.2 C38.2 | DD2.20 78.7,30.3 78,31 78,32.7 77.2,33.5 DD2.27 | 87.5,22.6 v88,23.1 | 52.85,15.05 52.75,15.05 51.75,16.05 DD3.17 | 48.8,21.5 48.55,21.25 DD3.3 | C4.2 49.35,25.8 50.75,24.4 50.75,24.05 51.25,23.55 DD3.35 51.25,22.15 | 51.75,17.5 51.75,17.95 | X2.SH4 25.87,5.52
  Top 0.3: C30.2 81.9,25 81.9,25.3 DD2.10 78.5,25.3 | 74.6,14.4 DD4.11 | DD4.12 73.9,14.4 73.9,13.4 | 75.3,14.4 75.4,14.3 75.5,14.4 DD4.10 75.4,14.39 75.4,13.4 | DD4.11 74.6,14.5 74.6,15.5 74.7,15.6 DD2.94 74.7,20.1 | 76.2,12.4 DD4.5 | 75.5,12.4 DD4.4 75.42,13.38 75.4,13.4 | 73.9,13.4 73.9,12.9 73.82,12.82 DD4.2 | 74.7,13.4 75.4,13.4 | DD4.11 74.62,13.48 74.7,13.4 | DD4.5 | C43.2 76.2,12.39 DD4.5 | 73.9,13.4 74.7,13.4 | 76.4,37.2 77.1,37.2 77.2,37.1 | DD2.27 77.2,37.1 | C37.- 85.6,34.9 85.4,35.1 | C37.- 85.6,31.8 84,31.8 C33.2 83.8,31.8 C39.2 | 82.3,31.5 C39.2 | C39.2 82.35,31.25 81.7,30.6 81.4,30.6 81.1,30.3 DD2.20 78.5,30.3 | 87.1,33.2 85.7,33.2 C37.- | C36.2 85.1,28.3 86.4,28.3 86.5,28.4 v86.5,28.2 86.2,28.2 86.2,27 86.1,26.9 85,26.9 C35.2 | 83.2,23.3 C26.2 | DD4.5 76.2,12.5 76.2,13.4 75.4,13.4 | C42.2 63.2,35 63.2,36.4 62.5,37.1 C29.- 62.5,38.9 62.6,39 63.3,39 v63.8,38.4 | 62.75,21.3 DD2.74 65.2,21.3 66.2,22.3 71.1,22.3 v71,21.5 | v68.2,16.1 68.2,15.5 69.5,14.2 69.8,13.6 R19.1 | C44.2 79.5,16.7 77.9,16.7 77.2,17.4 DD2.99 77.2,20 | C34.- 79.9,37.2 77.3,37.2 77.2,37.1
  Top 0.4: 87.5,22.6 89.1,21 89.2,20.85 89.25,20.8 89.25,19.7 89.15,19.6 DD5.2 | 83.2,23.4 C26.2 | 69.8,13.5 R19.1
  Top 0.5: DA2.2 66.1,9.5 66,9.6 63.4,9.6 63.3,9.5 63.1,9.5 C32.2 | DA1.2 67.4,5.2 63.1,5.2 C31.2
  Bottom 0.26: D1.3 85,22.1 86.4,22.1 86.5,22.2 87.1,22.2 v88,23.1 88,23.3
  Bottom 0.3: v60.4,38.5 60.9,38 63.3,38 v63.8,38.4
  other vias: 98,6.15 4,33.75 4,6.25 49,1.75 49,38.25 98,33.85 63.2,2.2 68.3,2.2 72.8,9.5 80.3,12.9 78.4,14.5 10.6,36.3 17,36.5 10.9,14.5 38.1,20.2 97.1,20 91.4,23.1 85.6,32 97.3,15.3 90.9,14.2 90.9,7.7 41.5,33.8 21.7,34.8 81.7,4.8 33.5,14.4 34.1,23 35.2,24.7 57.3,14.6 54,9.7 49.35,28.3 27.1,21.3 45.6,18.8 58.8,9.4 58.7,4.6 26.4,13.7 28.7,11.6 14.35,3.6 8.6,27.3 11.35,33.9 69.3,7.1 80.5,1.1 85.7,7.1 84.3,12.5 81.3,38.8 89.2,28.1 91.2,4.2 51.8,7.4 17.1,16.8 24.6,17.1 12,22.5 12,24.8 18.3,28.7 22.2,28.4 22.4,25.1 26.7,25.1 30.9,28.3 32.4,24.5 25.8,28.5 34.8,29.9 49.7,21.3 52.3,18.7 36.1,11.6 30.6,14.7 36.7,5 76.5,30.7 77.7,24 70.2,28.6 65.7,32 39,17.8 42.9,7.6 71.9,26.9 80.9,24.4 73.3,24.5 82,28.9 87.6,34 61.15,28.2 54.9,12.6 61.4,14
  pour Top: 1,40 102,40 102,0 0,0 0,40
  pour Bottom: 0,40 102,40 102,0 0,0
I2S_MCK
  Top 0.2: DD2.63 63.2,26.8 62.8,27.2 62.8,28.6 61.8,29.6 57.9,29.6 57.5,30 53.4,30 52.7,29.3 48.1,29.3 48,29.2 48,26.5 50.3,24.2 50.3,23.1 DD3.37
I2S_SCK
  Top 0.2: DD3.38 49.8,23.1 49.8,24.1 47.6,26.3 47.6,29.4 47.9,29.7 52.5,29.7 53.2,30.4 57.7,30.4 58.1,30 58.7,30 59.4,30.7 59.4,31.3 60.3,32.2 62.8,32.2 62.9,32.3 DD2.52
I2S_SD  (via drill 0.4)
  Top 0.2: DD3.39 49.3,23.1 49.3,24 47.2,26.1 47.2,29.6 47.7,30.1 52.3,30.1 53,30.8 57.5,30.8 57.7,31 v58.4,31 | DD2.54 60.6,31.3 60.4,31.1 v60.4,31
  Bottom 0.2: v58.4,31 v60.4,31
I2S_WS
  Top 0.2: DD2.51 62.8,32.8 62.6,32.6 60.1,32.6 59.5,32 58.1,32 57.3,31.2 52.8,31.2 52.1,30.5 47.5,30.5 46.8,29.8 46.8,25.9 48.8,23.9 48.8,23.1 DD3.40
MEMS_INT1
  Top 0.3: DD2.96 75.7,16.2 77,14.9 77,14.5 DD4.8
MEMS_INT2
  Top 0.3: DD2.95 75.2,15.9 76.2,14.9 76.2,14.5 DD4.9
MEMS_SCL
  Top 0.3: DD4.14 73,13.4 72.2,13.4 72.1,13.5 72.1,15 72.9,15.8 73.3,15.8 73.7,16.2 DD2.92
MEMS_SDA
  Top 0.3: DD2.93 74.2,15.9 73.6,15.3 73.2,15.3 73,15.1 73,14.6 DD4.13 73,14.5
N$1  (via drill 0.4)
  Top 0.5: v96.6,25.9 96.6,26.1 96.4,26.3 R25.1
  Bottom 0.5: v96.6,25.9 96.6,23.2 95.9,22.5 95.9,17.4 95.7,17.3 94.4,16 85,16 D1.8
N$2
  Top 0.3: DD3.18 52.25,16.25 52.95,15.55 55.8,15.55 C10.1
N$3
  Top 0.26: DD3.27 55,20.75 C13.1
N$4
  Top 0.26: DD3.28 54.55,21.25 54.95,21.65 54.95,23.5 55,23.55 C15.1
N$5
  Top 0.26: C19.1 55.1,17.95 54.95,17.8 54.95,17.2 53.8,16.05 53.15,16.05 52.75,16.45 DD3.19
N$6  (via drill 0.4)
  Top 0.26: DD3.14 50.25,12.15 50.2,12.1 49.7,11.6 C11.1 | 21.5,19.2 21.6,19.2
  Top 0.3: 49.7,11.4 C11.1 | 49.7,11.3 C11.1 | v49.8,8.6 50.2,9 50.2,12.1 C11.1 | 21.6,19.2 22,18.8 22,15.9 22.3,15.6 23.4,15.6 v24.3,14.7
  Top 0.4: X1.B 10.95,18.4 16.6,18.4 17.4,19.2 VD4.2 21.5,19.2
  Bottom 0.3: v24.3,14.7 24.3,14.5 23.6,13.8 23.6,13 22.9,12.3 20.6,12.3 19.7,11.4 19.7,7.4 22.1,5 35.1,5 36.1,4 45,4 47.1,6.1 47.9,6.1 49.8,8 v49.8,8.6
N$7  (via drill 0.4)
  Top 0.26: C14.1 50.75,12.1 DD3.15
  Top 0.3: 51.4,11.4 C14.1 | v23.1,14.6 22.6,15.1 17.5,15.1 15.5,17.1 | 51.4,11.3 C14.1 | v51.2,8.6 50.8,8.9 50.8,12.1 C14.1
  Top 0.4: X1.A 11.3,16.6 11.8,17.1 VD3.2 15.5,17.1
  Bottom 0.3: v23.1,14.6 23.1,13.3 22.6,12.8 20.3,12.8 19.2,11.7 19.2,7.1 21.8,4.5 34.8,4.5 35.8,3.5 45.3,3.5 47.4,5.6 48.2,5.6 v51.2,8.6
N$8
  Top 0.26: C8.1 47.95,15.15 48.75,15.95 DD3.11
N$9
  Top 0.26: C8.2 44.75,13.85 45.5,14.6 48.1,14.6 49.25,15.75 DD3.12
N$10
  Top 0.26: DD3.10 45.35,17.75 45.25,17.65 C5.1
N$11
  Top 0.4: X1.AGND 6.9,21.8 10,24.9 R14.2
N$12
  Top 0.3: R10.2 48.5,11.5 C11.2
N$13
  Top 0.3: R11.2 52.5,11.5 C14.2
N$14
  Top 0.8: VT5.3 17.25,24.4 M1.1
N$16
  Top 0.5: DD1.4 86.7,10.4 86.6,10.5 86.7,10.6 86.7,11.3 86.6,11.4 86.6,12.8 R2.2 86.6,13 86.6,13.2 87.4,13.2 87.7,13.5 C3.1
N$17  (via drill 0.4)
  Top 0.2: v77.3,7.8 75,7.8 74.9,7.7 74.9,6.5 R7.1 | 92.7,8.7 VD1.C | v94.7,9.5 94.65,9.55
  Top 0.5: VT1.2 95.8,9.6 94.7,9.6 94.65,9.55 94.4,9.3 94.4,8.8 94,8.4 92.9,8.4 VD1.C 92.8,8.2 92.8,6.9 VT4.2 92.5,6.7 93.1,6.7 93.4,6.4 94.6,6.4 R8.2
  Bottom 0.2: v77.3,7.8 77.9,7.2 79,7.2 80.3,8.5 84.8,8.5 85.7,9.4 91.6,9.4 91.8,9.6 94.7,9.6 v94.7,9.5
N$18
  Top 0.3: 83.3,28.2 R16.1 | 83.4,28.1 R16.1 | DD2.13 81.97,26.8 R16.1
N$19
  Top 0.5: VT6.3 R25.2
N$21  (via drill 0.4)
  Top 0.26: VT3.C 83.2,5.5 85.5,5.5 86.1,4.9 VT2.C
  Top 0.3: VT2.C 86.1,1.91 84.5,1.91 v84.5,2.1 83.79,2.81 VD2.A | R8.1 94.3,4.7 94.3,3.2 v94.4,3.2
  Top 0.5: R8.1 94.6,4.9 93.4,4.9 93.3,4.8 92.5,4.8 VT4.1
  Bottom 0.3: v94.4,3.2 94.1,3.2 92.2,5.1 87.5,5.1 v84.5,2.1
N$22
  Top 0.5: XT1.3 92.4,20 91.8,20.6 90.7,20.6 DD5.6
N$29
  Top 0.5: XT1.2 92.4,19.2 91.9,18.7 90.7,18.7 DD5.4
N$31
  Top 0.3: DD2.73 61.4,21.8 60.6,21 C25.+
N$33
  Top 0.3: DD2.12 82.9,26.3 83.6,25.6 84.9,25.6 C35.1 85.1,25.6 86.3,25.6 86.5,25.8 ZQ1.P$1
N$34
  Top 0.5: C24.1 61.5,10.4 61.5,10.5 64.8,10.5 DA2.4
N$35
  Top 0.5: DA1.4 64.83,6.1 C23.1
N$38
  Top 0.3: C29.+ 65.5,36.6 66.2,35.9 DD2.49
N$40
  Top 0.3: DD2.22 80.4,31.3 80.4,32.2 81.5,33.3 R17.2 81.5,37 82.9,37 | 84.4,37 84.4,36.2 C40.1 | C34.+ 82.9,37 | 84.4,37 82.9,37 | L1.2 85.6,37 84.4,37
N$42
  Top 0.3: R17.1 82.9,35.2 82.6,34.9 C37.+ 82.6,32.9 81.9,32.9 81.5,32.5 81.5,31.9 C39.1 81.3,31.8 80.9,31.4 80.9,30.9 80.8,30.8 DD2.21
N$44
  Top 0.3: R16.2 83.4,29.6 84.9,29.6 C36.1 85.1,29.6 86.4,29.6 87.6,30.8 ZQ1.P$2
NRST  (via drill 0.4)
  Top 0.2: DD2.14 77.9,27.3 76.4,25.8 75.1,25.8 74.4,26.5 73.5,26.5 70.2,29.8 v70.2,31.2 | 53.9,34.1 46.4,34.1 45.3,35.2 43,35.2 41.6,36.6 38.1,36.6 | 27,34.3 27,33 JP1.4 | C16.1 38.1,35.8 38.1,36.6 | 53.9,34.1 v53.9,33.4 | R12.1 54.05,34.1 53.9,34.1 | 28.4,35.7 28.4,35.8 32.4,35.8 33.2,36.6 38.1,36.6
  Top 0.3: 27,32.9 JP1.4
  Top 0.4: 27,34.3 28.4,35.7
  Bottom 0.2: v53.9,33.4 54.5,34 67.4,34 v70.2,31.2
NVBTR  (via drill 0.4)
  Top 0.26: 21.3,23.5 VT5.1 21.4,23.5 22.5,23.5 v23.5,24.5 | v72.7,20.4 DD2.90 | v41.8,12.8 40.6,12.8 36.7,16.7 v36.7,18.7
  Top 0.3: R24.2 19.6,25.5 20.3,24.6 20.3,23.5 21.1,23.5 VT5.1 21.2,23.5
  Bottom 0.26: v72.7,20.4 69.1,20.4 68.8,20.1 66.3,20.1 66.2,20 66.2,17.4 63.9,15.1 62.2,15.1 61.4,15.9 56.6,15.9 53.9,13.2 42.2,13.2 v41.8,12.8 | v36.7,18.7 31.3,24.1 28.2,24.1 28.1,24.2 23.8,24.2 v23.5,24.5
PWR_EN  (via drill 0.4)
  Top 0.2: v84.15,9.7 VT3.B | v71.95,30.55 72.35,30.95 72.35,33.7 72.2,33.85 DD2.37
  Bottom 0.2: v84.15,9.7 81.85,12 81.85,13.55 75.65,19.75 75.65,25.35 73.95,27.05 73.95,29.3 72.7,30.55 v71.95,30.55
SCL  (via drill 0.4)
  Top 0.2: v57.1,33 57.1,32.2 56.9,32 52.4,32 51.7,31.3 47.1,31.3 46,30.2 46,21.75 | v59.2,33 62.4,33 62.7,33.3 64.7,33.3 64.9,33.1 66.9,33.1 67.2,33.4 DD2.47 | R6.1 46,21.75 | 46,21.75 DD3.2
  Bottom 0.2: v57.1,33 v59.2,33
SD_CK
  Top 0.26: R19.2 68.3,13.6 67.3,14.6 67.3,17.3 67.7,17.7 DD2.80 67.7,20.3 67.6,20.4 65.7,20.4 64.6,19.3 63.7,19.3 62.1,17.7 62.1,15.6 62.3,15.4 62.3,13.4 61.9,13 58.7,13 52.2,6.5 39.6,6.5 32,14.1 32,17.5 X2.CLK
  Top 0.3: 68.2,13.4 68.3,13.5 R19.2
SD_CMD
  Top 0.26: 69.7,16.1 R21.1 | 69.7,16.2 R21.1 | DD2.83 69.2,18.3 69.7,17.8 69.7,16.3 R21.1
  Top 0.3: 29.8,17.5 X2.CMD 29.75,18.35 28.6,19.5 26.5,19.5 26,19 26,16 31.3,10.7 33.2,10.7 38.9,5 52.9,5 59.4,11.5 70.2,11.5 71.1,12.4 71.1,14.7 70.9,14.9 69.9,14.9 69.7,15.1 69.7,16.1
SD_D0  (via drill 0.4)
  Top 0.26: X2.DAT0 34.2,17.7 34.2,18.8 34.4,19 34.4,21.9 34.9,22.4 37.1,22.4 37.5,22 38.5,22 39.1,22.6 39.1,24.4 38.9,24.6 37.7,24.6 37.1,25.2 37.1,26.1 37.9,26.9 v41.2,26.9 | v61.3,26.8 61.4,26.7 61.4,25.8
  Top 0.3: DD2.65 61.4,25.8 60.4,25.8 60.2,25.6 60.1,25.7 60,25.6 R22.1 60.1,25.8 | 34.2,17.6 X2.DAT0
  Bottom 0.26: v61.3,26.8 61.3,25.2 60.3,24.2 57.8,24.2 56,26 42.1,26 v41.2,26.9
SD_D1  (via drill 0.4)
  Top 0.26: X2.DAT1 35.3,17.7 35.3,18.7 34.9,19.1 34.9,21.7 35.1,21.9 36.9,21.9 37.3,21.5 38.7,21.5 39.6,22.4 39.6,24.6 39.1,25.1 38.5,25.1 v38,25.6
  Top 0.3: DD2.66 61.8,25.3 60.7,24.2 60.2,24.2 60.1,24.1 60.1,23.5 R23.1 60.1,23.4 60.1,22.3 59.8,22 v57.5,22 | 35.3,17.6 X2.DAT1
  Bottom 0.3: v38,25.6 39.4,25.6 40.7,24.3 55.2,24.3 v57.5,22
SD_D2
  Top 0.26: X2.DAT2 27.6,17.5 27.6,15.9 31.8,11.7 33.7,11.7 39.4,6 52.4,6 58.9,12.5 62.1,12.5 62.8,13.2 62.8,15.4 63.8,16.4 65.7,16.4 | 65.7,16.4 65.8,16.3 65.8,15.1 R18.1 | DD2.78 66.7,18.1 65.8,17.2 65.8,16.4 65.7,16.4
SD_D3
  Top 0.26: DD2.79 67.2,17.9 66.8,17.5 66.8,13.6 R20.1
  Top 0.3: 66.8,13.5 R20.1 66.8,13.4 66.8,12.1 66.7,12 59.1,12 52.6,5.5 39.2,5.5 33.5,11.2 31.6,11.2 26.5,16.3 26.5,18.7 26.8,19 28.3,19 28.7,18.6 28.7,17.2 X2.CD/DAT3
SD_INS  (via drill 0.4)
  Top 0.26: v57.6,8.3 57.2,8.6 53.1,4.5 38.7,4.5 36.1,7.1 34.6,7.1 X2.SNS1 | DD2.82 68.7,20 67.8,20.9 65.5,20.9 64.4,19.8 63.5,19.8 61.6,17.9 61.6,15.5 60.7,14.6 v59.4,14.6
  Top 0.5: X2.SNS1 34.4,7.1 33.3,7.1 33.2,7.2 33.2,8.3 33.1,8.4 30.1,8.4 30,8.3 30,7.2 29.9,7.1 28.8,7.1 X2.SNS2
  Bottom 0.26: v57.6,8.3 57.1,8.8 57.1,12.3 v59.4,14.6
SDA
  Top 0.2: DD2.48 66.7,33.8 66.4,33.5 65.1,33.5 64.9,33.7 61.25,33.7 R4.1 61.1,33.9 59.8,33.9 59.7,34 58.7,34 58.2,33.5 58.2,32.7 57.1,31.6 52.6,31.6 51.9,30.9 47.3,30.9 46.4,30 46.4,22.5 46.6,22.3 47.9,22.3 DD3.1
SWCLK  (via drill 0.4)
  Top 0.26: DD2.76 65.7,18.6 65.2,18.6 64.8,18.2 v63.8,18.2 | v39.8,14.8 40.1,15.1 40.1,24.6 42.3,26.8 42.3,30.4 39.6,33.1 38.4,33.1 C46.2
  Top 0.5: 34.6,33 JP1.1 34.8,33.1 38,33.1 C46.2 38.2,33
  Bottom 0.26: v63.8,18.2 62.4,18.2 62.1,17.9 55.8,17.9 53.1,15.2 40.2,15.2 v39.8,14.8
SWDIO  (via drill 0.4)
  Top 0.26: v61.5,23 62.3,22.3 DD2.72
  Top 0.3: 29.5,32.9 JP1.3
  Top 0.5: 29.5,31.5 29.5,32.8 JP1.3 29.6,31.4 v29.6,26.2
  Bottom 0.26: v29.6,26.2 29.7,26.4 30,26.7 39,26.7 40.9,24.8 55.4,24.8 57.2,23 v61.5,23
  Bottom 0.3: v29.6,26.2 29.6,26.3
SWO  (via drill 0.4)
  Top 0.2: DD2.89 v72.2,17.7 | v32.4,28.3 32.4,27.5 30.3,25.4 29.2,25.4 28.1,26.5 28.1,29 27.6,29.5 26.4,29.5 26.3,29.6 | 24.4,31.5 24.4,32.9 JP1.5
  Top 0.4: 24.4,31.5 26.3,29.6
  Bottom 0.2: v72.2,17.7 74.4,19.9 74.4,24.8 72.7,26.5 72.7,27.5 69.4,30.8 69.4,31.4 67.2,33.6 65.1,33.6 59.2,27.7 59.2,26.9 58.8,26.5 42.9,26.5 41.5,27.9 32.8,27.9 v32.4,28.3
U_DM
  Top 0.2: 88,18.7 DD5.3
  Top 0.3: 88.1,18.7 DD5.3 | DD2.70 71.8,23.3 72.8,22.3 76.6,22.3 78.7,20.3 80.3,20.3 81,19.6 82.1,19.6 83,18.7 87.8,18.7 DD5.3 | 87.9,18.7 DD5.3
U_DP  (via drill 0.4)
  Top 0.3: v79.9,19.3 79.4,19.8 78.4,19.8 76.4,21.8 72.5,21.8 71.5,22.8 DD2.71 | v81.3,20.7 81.4,20.6 88.1,20.6 DD5.1
  Bottom 0.3: v79.9,19.3 v81.3,20.7
VBAT  (via drill 0.4)
  Top 0.25: 68.5,4.5 68.5,4.3 | 67.5,4.3 67.5,4.28 DA1.1 | 67.5,6.2 67.5,6.18 DA1.3
  Top 0.3: 68.5,4.5 68.5,6.2 67.5,6.2 | DA2.3 68.5,10.45 68.5,8.6
  Top 0.5: 69.3,4.3 70.5,4.3 70.6,4.4 70.9,4.4 C17.1 | C20.1 69.3,4.3 | 69.3,4.3 68.5,4.3 67.5,4.3 | DA2.1 67.4,8.6 68.5,8.6 69.3,8.6 C21.1 69.8,8.6 70.1,8.6 70.2,8.7 70.9,8.7 C18.1 | VT6.2 92.7,32.1 92.7,33.3 92.9,33.5 R26.1 v91.6,33.8 | 67.4,6.2 DA1.3 67.4,6.4 DA2.1 | 67.2,8.6 DA2.1 | 20.8,28.3 C47.1 | C47.1 21,28.2 R24.1 21,25.5 21.1,25.4 VT5.2 | v72.9,4.8 72.7,4.8 72.3,4.4 71.1,4.4 | v18.9,35.2 18.9,31 20.8,29.1 20.8,28.5 C47.1
  Top 0.8: 71.1,4.4 C17.1 | v89.3,7 89.3,5.8 89.4,5.7 VT4.3
  Bottom 0.5: 89.3,6.2 86.9,6.2 84.5,3.8 83.4,3.8 82.7,3.1 76.9,3.1 75.6,4.4 73,4.4 72.9,4.5 v72.9,4.8 | 89.3,6.2 v89.3,7 | 89.3,6.2 93,6.2 98.3,11.5 98.3,16.7 98.8,17.2 98.8,22.7 98.1,23.4 98.1,26.8 96.3,28.6 96.3,30.1 95.6,30.8 93.5,30.8 91,33.3 | 91,33.3 88.4,35.9 82,35.9 81.8,36.1 81.8,36.5 80.8,37.5 72.9,37.5 71.1,39.3 66.5,39.3 66.3,39.2 64.5,37.4 52.2,37.4 50.2,35.4 47.5,35.4 46.2,36.7 20.8,36.7 19.3,35.2 v18.9,35.2 | v91.6,33.8 91.5,33.8 91,33.3
VBAT0  (via drill 0.4)
  Top 0.5: B1.+ 14,5.2 13.85,5.15 13.8,5.1 v13.8,5 | v65.5,25.9 74.1,25.9 74.8,25.2 76.3,25.2 v76.65,24.85
  Top 0.6: DD1.3 89.3,10.5 91,10.5 | VT1.3 91,10.5 | v91,10.7 91,10.5
  Bottom 0.5: v65.5,25.9 62.9,25.9 60.6,23.6 57.5,23.6 55.7,25.4 41.2,25.4 39.3,27.3 12,27.3 6.2,21.5 6.2,8.6 6.6,8.2 6.6,7.9 9.5,5 v13.8,5
  Bottom 0.6: v91,10.7 84.6,10.7 84.5,10.8 83.9,10.8 82.5,12.2 82.5,13.8 76.3,20 76.3,24.5 v76.65,24.85
VBUS  (via drill 0.4)
  Top 0.2: v82.3,16.9 82.8,17.4 87.6,17.4 C49.1 | v78,22.3 77.5,22.8 73,22.8 72,23.8 65.9,23.8 65.4,24.3 DD2.68
  Top 0.3: R2.1 89.4,12.2 89.4,11.5 89.3,11.4 88.2,11.4 88,11.2 88,6.3 87.1,5.4 87.1,4 VT2.B
  Top 0.4: 89.5,16.6 C48.1
  Top 0.5: 95.9,12.4 95.9,12.9 R1.2 | 95.9,12.4 92.9,12.4 VD1.A 92.7,12.4 89.4,12.4 89.4,12.6 R2.1 89.4,12.8 89.4,16.1 89.5,16.2 C48.1 89.5,16.8 89.5,17.3 | 95.9,11.5 95.9,12.4 | 95.9,11.5 95.9,11.4 | 95.9,11.5 96,11.4 VT1.1 | 87.9,17.3 C49.1 89.45,17.35 89.5,17.3 | DD5.5 90.1,19.6 89.5,19 89.5,17.7 | 89.5,17.3 89.5,17.7 | 89.5,17.7 92,17.7 92.7,18.4 XT1.1
  Bottom 0.2: v82.3,16.9 80.3,16.9 76.9,20.3 76.9,21.2 v78,22.3

### Text on the board
tPlace: SWO | NRST | SWDIO | GND | SWCLK | walk / geek | http://code.google.com/p/walkgeek
tStop: v1.0
bStop: code.google.com/p/walkgeek